# EAGLE schematic output-breakout (EAGLE 9.1.2)
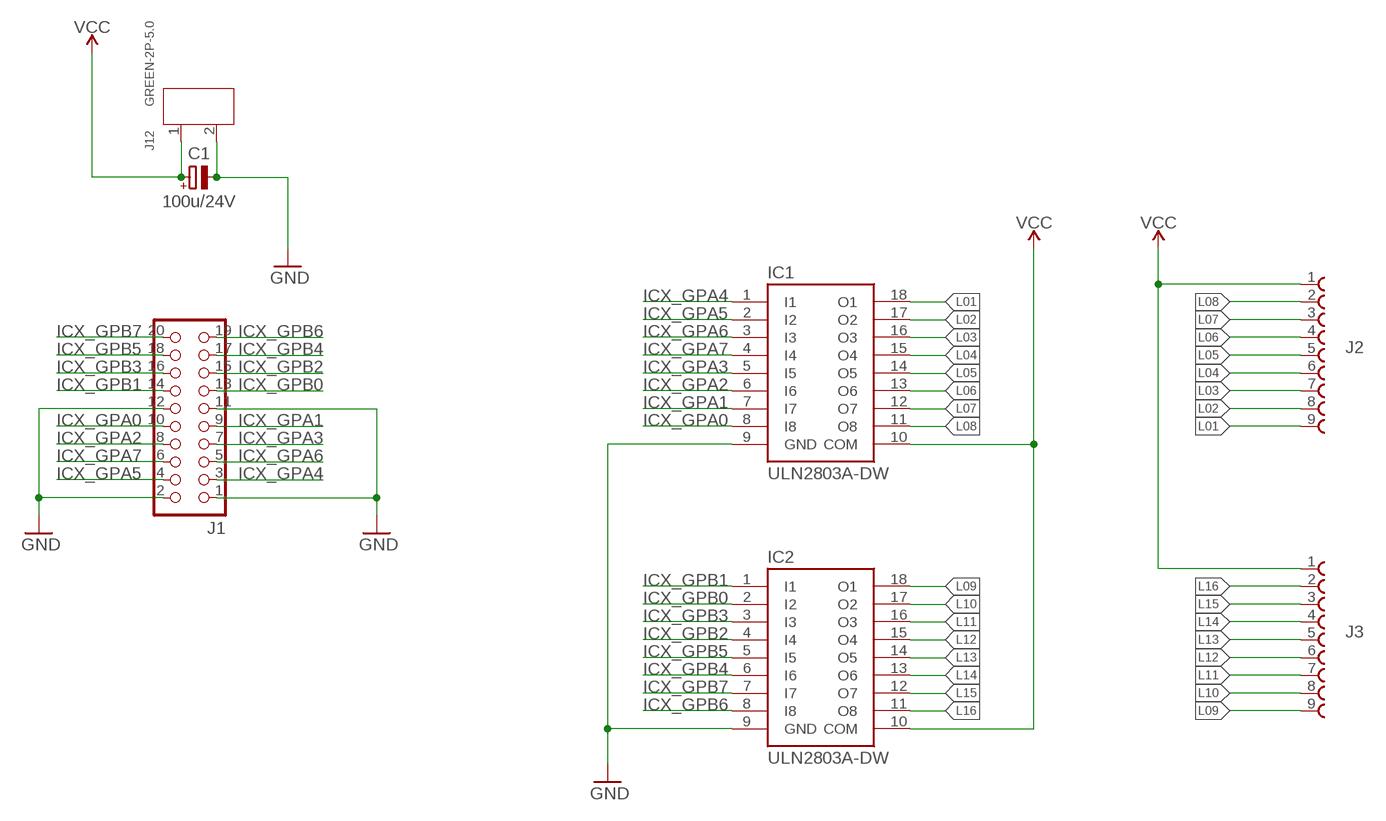
[diagram p0: schematic, sheet 1]

## Parts
C1  100u/24V  CAPACITOR_POL-E3.5-8  [E3.5-8]
IC1  ULN2803A-DW  [SO18W]
IC2  ULN2803A-DW  [SO18W]
J1  CON_HEADER_2X10-SHROUDED  [PINSHRD_PTH_2X10]
J2  69132211000_XX  [69132211000_XX]
J3  69132211000_XX  [69132211000_XX]
J12  GREEN-2P-5.0  SCREW-TERMINAL-GREEN(2P-5.0)  [H2-5.0-10.5X8.0MM]

## Nets
GND: C1.- IC1.9(GND) IC2.9(GND) J1.1 J1.2 J1.11 J1.12 J12.2
ICX_GPA0: IC1.8(I8) J1.10
ICX_GPA1: IC1.7(I7) J1.9
ICX_GPA2: IC1.6(I6) J1.8
ICX_GPA3: IC1.5(I5) J1.7
ICX_GPA4: IC1.1(I1) J1.3
ICX_GPA5: IC1.2(I2) J1.4
ICX_GPA6: IC1.3(I3) J1.5
ICX_GPA7: IC1.4(I4) J1.6
ICX_GPB0: IC2.2(I2) J1.13
ICX_GPB1: IC2.1(I1) J1.14
ICX_GPB2: IC2.4(I4) J1.15
ICX_GPB3: IC2.3(I3) J1.16
ICX_GPB4: IC2.6(I6) J1.17
ICX_GPB5: IC2.5(I5) J1.18
ICX_GPB6: IC2.8(I8) J1.19
ICX_GPB7: IC2.7(I7) J1.20
L01: IC1.18(O1) J2.9
L02: IC1.17(O2) J2.8
L03: IC1.16(O3) J2.7
L04: IC1.15(O4) J2.6
L05: IC1.14(O5) J2.5
L06: IC1.13(O6) J2.4
L07: IC1.12(O7) J2.3
L08: IC1.11(O8) J2.2
L09: IC2.18(O1) J3.9
L10: IC2.17(O2) J3.8
L11: IC2.16(O3) J3.7
L12: IC2.15(O4) J3.6
L13: IC2.14(O5) J3.5
L14: IC2.13(O6) J3.4
L15: IC2.12(O7) J3.3
L16: IC2.11(O8) J3.2
VCC: C1.+ IC1.10(COM) IC2.10(COM) J2.1 J3.1 J12.1

## Library data of the parts
C1 = we-rcl:CAPACITOR_POL: Polarized Capacitors
IC1 IC2 = we-chip:ULN2803A: ULN2803 8-Bit Transistor Array (Low Side)
J1 = dp_devices:CON_HEADER_2X10
J2 J3 = dadamachines:69132211000_XX: Terminal block - 9 Pins;
J12 = Seeed-Connector:SCREW-TERMINAL-GREEN(2P-5.0): 320110031